# Altium schematic sheet power-sheet.SchDoc: Power Regulator
size 420 x 297 mm; CheckedBy: E.Orzes F.Martina S.Baron; CompanyName: CERN; DrawnBy: E.Orzes; Organization: CERN; Address1: European Organization for Nuclear Research; Address2: CH-1211 Genève 23 - Switzerland; SheetNumber: 7; SheetTotal: 7; Projet: Phase Stable Link; DivGrp: EP-ESE; Designer: E.Orzes; ModifiedDate: -
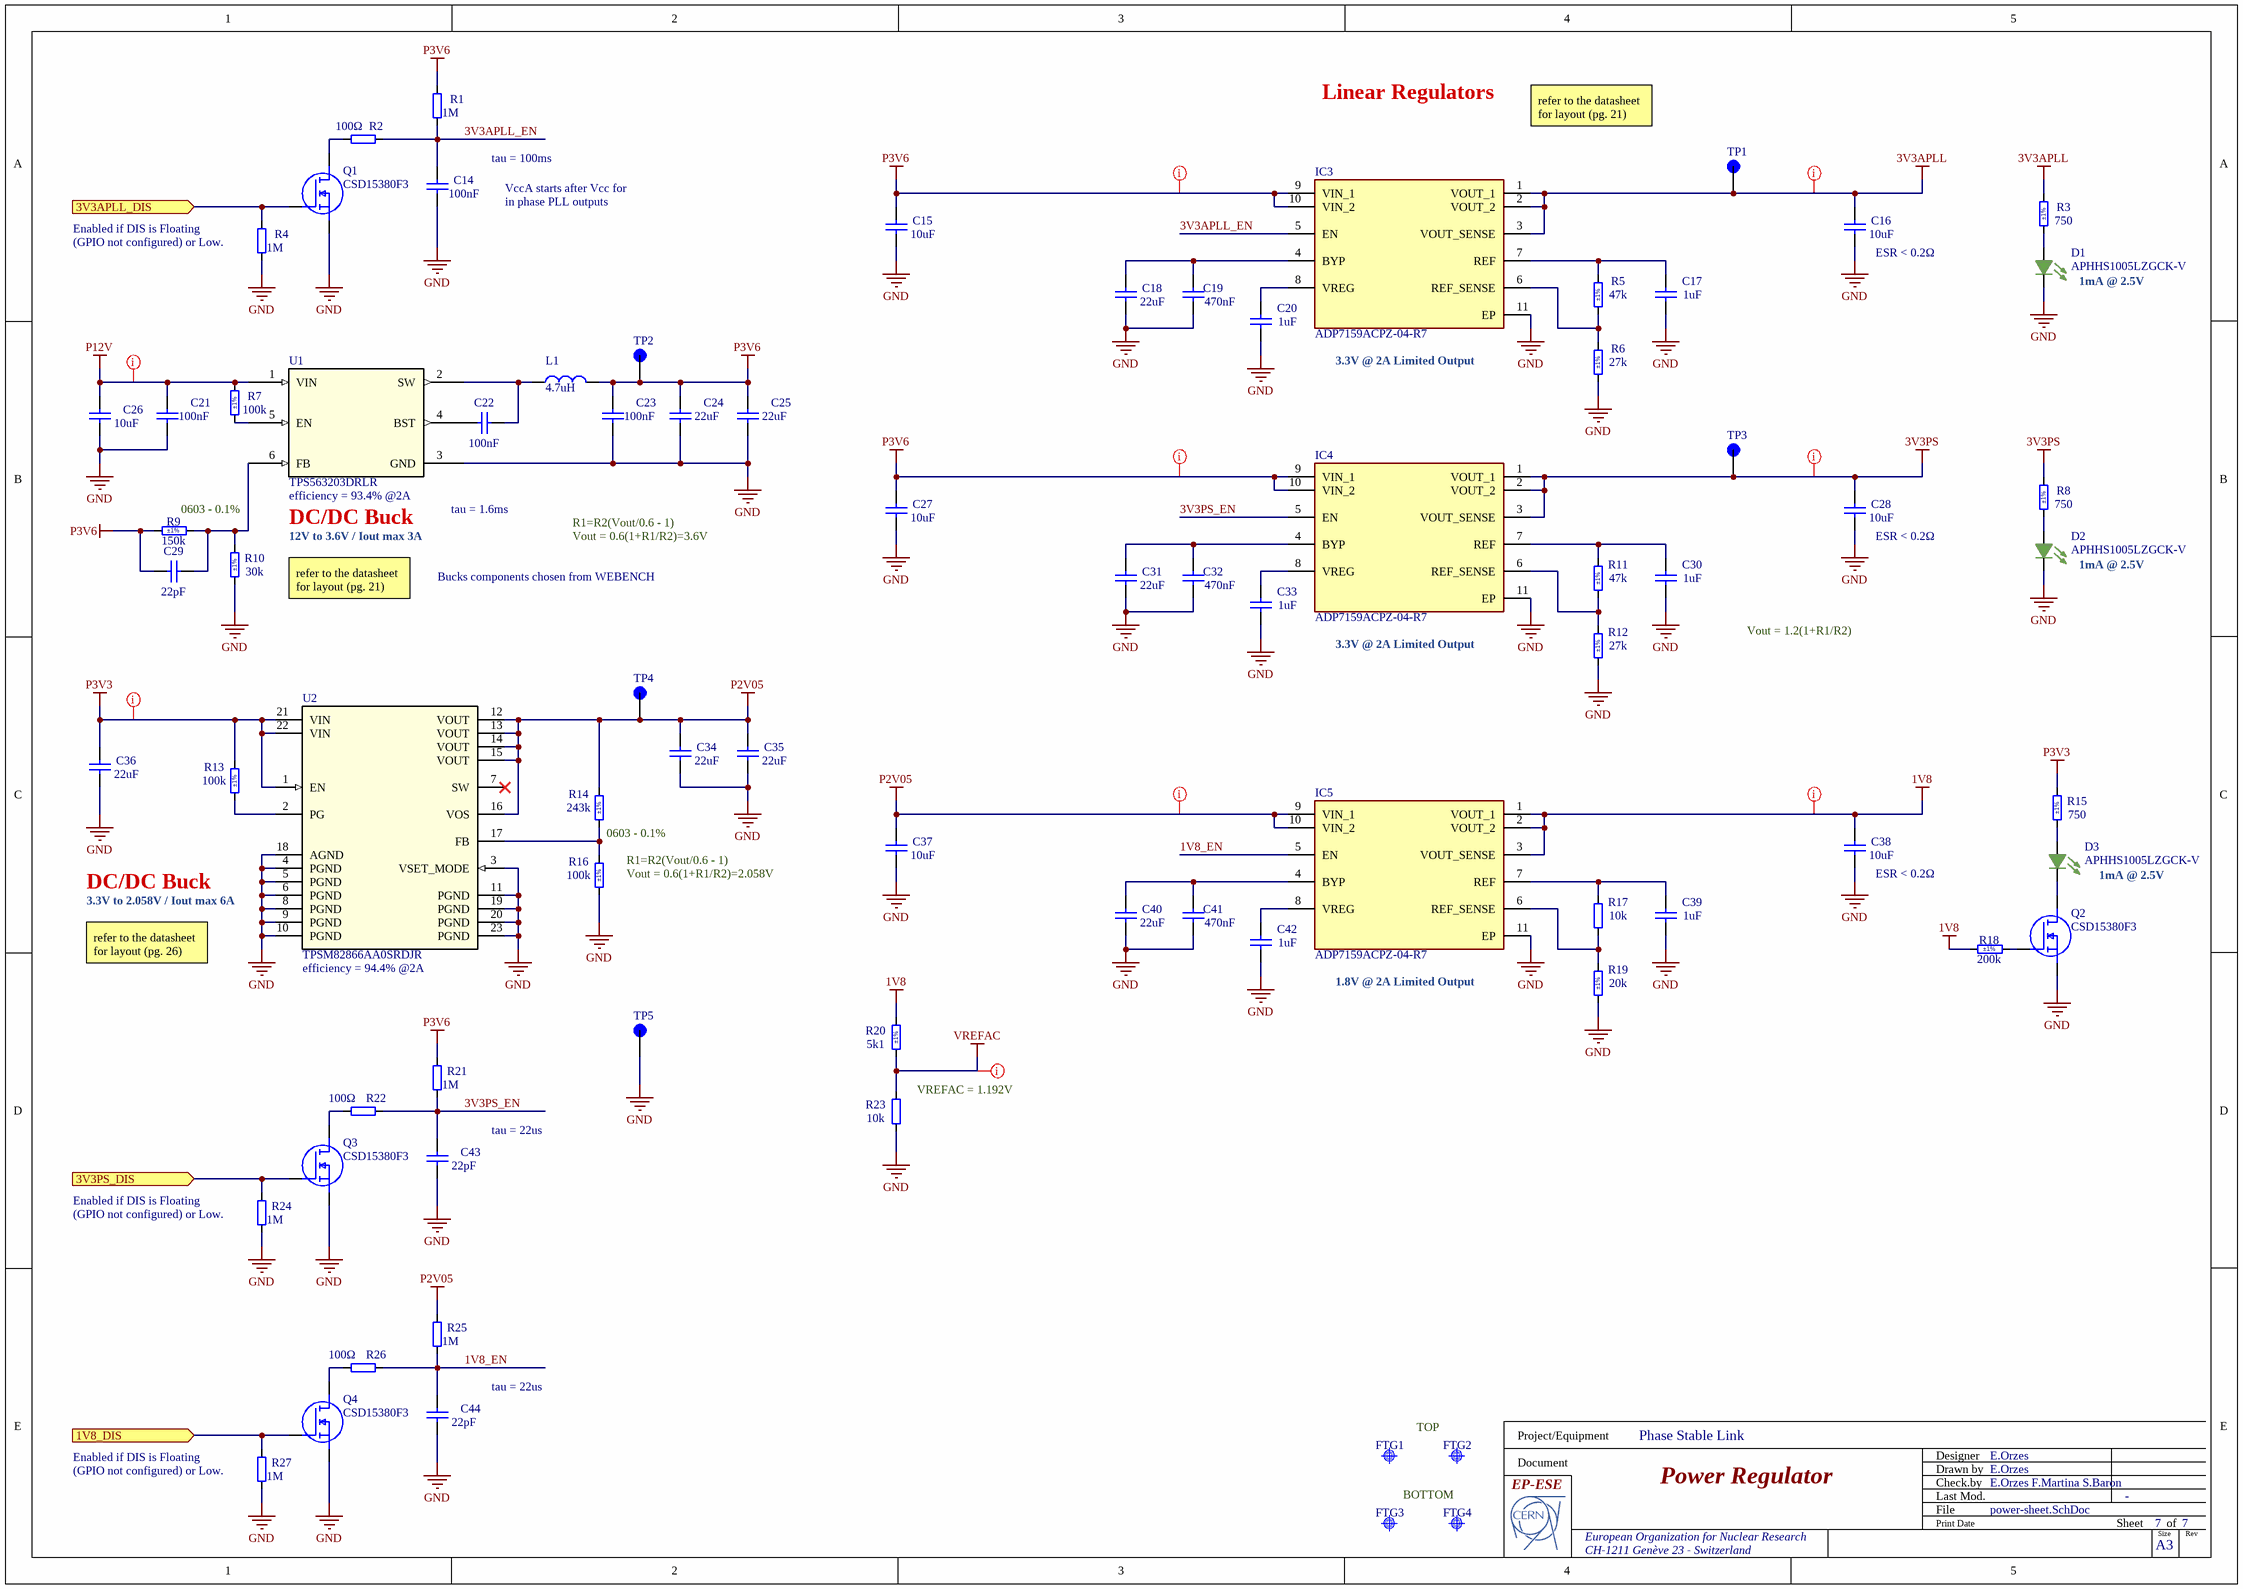
[diagram p0: power-sheet.SchDoc]

## Parts
C14  100nF  [MURATA_HI_DENSITY_0201]
C15  10uF  [CAPC1608X87N]
C16  10uF  [CAPC1608X87N]
C17  1uF  [CAPC1005X55N]
C18  22uF  [MURATA_HI_DENSITY_0402_CAP]
C19  470nF  [CAPC0510X04N]
C20  1uF  [CAPC1005X55N]
C21  100nF  [MURATA_HI_DENSITY_0402_CAP]
C22  100nF  [MURATA_HI_DENSITY_0402_CAP]
C23  100nF  [MURATA_HI_DENSITY_0402_CAP]
C24  22uF  [MURATA_HI_DENSITY_0402_CAP]
C25  22uF  [MURATA_HI_DENSITY_0402_CAP]
C26  10uF  [CAPC1608X87N]
C27  10uF  [CAPC1608X87N]
C28  10uF  [CAPC1608X87N]
C29  22pF  [MURATA_HI_DENSITY_0402_CAP]
C30  1uF  [CAPC1005X55N]
C31  22uF  [MURATA_HI_DENSITY_0402_CAP]
C32  470nF  [CAPC0510X04N]
C33  1uF  [CAPC1005X55N]
C34  22uF  [MURATA_HI_DENSITY_0402_CAP]
C35  22uF  [MURATA_HI_DENSITY_0402_CAP]
C36  22uF  [MURATA_HI_DENSITY_0402_CAP]
C37  10uF  [CAPC1608X87N]
C38  10uF  [CAPC1608X87N]
C39  1uF  [CAPC1005X55N]
C40  22uF  [MURATA_HI_DENSITY_0402_CAP]
C41  470nF  [CAPC0510X04N]
C42  1uF  [CAPC1005X55N]
C43  22pF  [MURATA_HI_DENSITY_0402_CAP]
C44  22pF  [MURATA_HI_DENSITY_0402_CAP]
D1  APHHS1005LZGCK-V  [LED_APHHS1005LZGCK-V]
D2  APHHS1005LZGCK-V  [LED_APHHS1005LZGCK-V]
D3  APHHS1005LZGCK-V  [LED_APHHS1005LZGCK-V]
FTG1  Use only in PCB  [FIDUCIAL_TOP_C100-200]  (value not drawn)
FTG2  Use only in PCB  [FIDUCIAL_TOP_C100-200]  (value not drawn)
FTG3  Use only in PCB  [FIDUCIAL_TOP_C100-200]  (value not drawn)
FTG4  Use only in PCB  [FIDUCIAL_TOP_C100-200]  (value not drawn)
IC3  ADP7159ACPZ-04-R7  [SON50P300X300X85-11N-D]
IC4  ADP7159ACPZ-04-R7  [SON50P300X300X85-11N-D]
IC5  ADP7159ACPZ-04-R7  [SON50P300X300X85-11N-D]
L1  4.7uH  [DFE322520FD1R0MP2]
Q1  CSD15380F3  [CSD15380F3]
Q2  CSD15380F3  [CSD15380F3]
Q3  CSD15380F3  [CSD15380F3]
Q4  CSD15380F3  [CSD15380F3]
R1  1M  [MURATA_HI_DENSITY_0201]
R2  100Ω  [MURATA_HI_DENSITY_0201]
R3  750  Tolerance: ±1%  [RESC1005X40N]
R4  1M  [MURATA_HI_DENSITY_0201]
R5  47k  Tolerance: ±1%  [RESC1005X40N]
R6  27k  Tolerance: ±1%  [RESC1005X40N]
R7  100k  Tolerance: ±1%  [RESC1608X55N]
R8  750  Tolerance: ±1%  [RESC1005X40N]
R9  150k  Tolerance: ±1%  [RESC1608X55N]
R10  30k  Tolerance: ±1%  [RESC1608X55N]
R11  47k  Tolerance: ±1%  [RESC1005X40N]
R12  27k  Tolerance: ±1%  [RESC1005X40N]
R13  100k  Tolerance: ±1%  [RESC1608X55N]
R14  243k  Tolerance: ±1%  [RESC1608X55N]
R15  750  Tolerance: ±1%  [RESC1005X40N]
R16  100k  Tolerance: ±1%  [RESC1608X55N]
R17  10k  [MURATA_HI_DENSITY_0201]
R18  200k  Tolerance: ±1%  [RESC1005X40N]
R19  20k  Tolerance: ±1%  [RESC1005X40N]
R20  5k1  Tolerance: ±1%  [RESC1005X40N]
R21  1M  [MURATA_HI_DENSITY_0201]
R22  100Ω  [MURATA_HI_DENSITY_0201]
R23  10k  [MURATA_HI_DENSITY_0201]
R24  1M  [MURATA_HI_DENSITY_0201]
R25  1M  [MURATA_HI_DENSITY_0201]
R26  100Ω  [MURATA_HI_DENSITY_0201]
R27  1M  [MURATA_HI_DENSITY_0201]
TP1  RCU-0C  [TP+195X110]  (value not drawn)
TP2  RCU-0C  [TP+195X110]  (value not drawn)
TP3  RCU-0C  [TP+195X110]  (value not drawn)
TP4  RCU-0C  [TP+195X110]  (value not drawn)
TP5  RCU-0C  [TP+195X110]  (value not drawn)
U1  TPS563203DRLR  [SOT_07SDRLR_TEX]
U2  TPSM82866AA0SRDJR  [RDJ0023A-MFG]

## Ports
1V8_DIS (in), 3V3APLL_DIS (in), 3V3PS_DIS (in)

## Nets
1V8: C38.2 IC5.1(VOUT_1) IC5.2(VOUT_2) IC5.3(VOUT_SENSE) R18.1 R20.2
3V3APLL: C16.2 IC3.1(VOUT_1) IC3.2(VOUT_2) IC3.3(VOUT_SENSE) R3.2 TP1.1(TP)
3V3PS: C28.2 IC4.1(VOUT_1) IC4.2(VOUT_2) IC4.3(VOUT_SENSE) R8.2 TP3.1(TP)
GND: C14.1 C15.1 C16.1 C17.1 C18.1 C19.1 C20.1 C21.2 C23.2 C24.1 C25.1 C26.1 C27.1 C28.1 C30.1 C31.1 C32.1 C33.1 C34.1 C35.1 C36.1 C37.1 C38.1 C39.1 C40.1 C41.1 C42.1 C43.2 C44.2 D1.1(C) D2.1(C) IC3.11(EP) IC4.11(EP) IC5.11(EP) Q1.2(S) Q2.2(S) Q3.2(S) Q4.2(S) R4.2 R6.1 R10.1 R12.1 R16.1 R19.1 R23.1 R24.2 R27.2 TP5.1(TP) U1.3(GND) U2.3(VSET_MODE) U2.4(PGND) U2.5(PGND) U2.6(PGND) U2.8(PGND) U2.9(PGND) U2.10(PGND) U2.11(PGND) U2.18(AGND) U2.19(PGND) U2.20(PGND) U2.23(PGND)
P2V05: C34.2 C35.2 C37.2 IC5.9(VIN_1) IC5.10(VIN_2) R14.2 R25.1 TP4.1(TP) U2.12(VOUT) U2.13(VOUT) U2.14(VOUT) U2.15(VOUT) U2.16(VOS)
P3V3: C36.2 R13.2 R15.2 U2.1(EN) U2.21(VIN) U2.22(VIN)
P3V6: C15.2 C23.1 C24.2 C25.2 C27.2 C29.2 IC3.9(VIN_1) IC3.10(VIN_2) IC4.9(VIN_1) IC4.10(VIN_2) L1.2 R1.1 R9.1 R21.1 TP2.1(TP)
P12V: C21.1 C26.2 R7.2 U1.1(VIN)
VREFAC: R20.1 R23.2
1V8_DIS: Q4.1(G) R27.1 ; port 1V8_DIS
1V8_EN: C44.1 IC5.5(EN) R25.2 R26.2
3V3APLL_DIS: Q1.1(G) R4.1 ; port 3V3APLL_DIS
3V3APLL_EN: C14.2 IC3.5(EN) R1.2 R2.2
3V3PS_DIS: Q3.1(G) R24.1 ; port 3V3PS_DIS
3V3PS_EN: C43.1 IC4.5(EN) R21.2 R22.2
NetC17_2: C17.2 IC3.7(REF) R5.2
NetC18_2: C18.2 C19.2 IC3.4(BYP)
NetC20_2: C20.2 IC3.8(VREG)
NetC22_1: C22.1 L1.1 U1.2(SW)
NetC22_2: C22.2 U1.4(BST)
NetC29_1: C29.1 R9.2 R10.2 U1.6(FB)
NetC30_2: C30.2 IC4.7(REF) R11.2
NetC31_2: C31.2 C32.2 IC4.4(BYP)
NetC33_2: C33.2 IC4.8(VREG)
NetC39_2: C39.2 IC5.7(REF) R17.2
NetC40_2: C40.2 C41.2 IC5.4(BYP)
NetC42_2: C42.2 IC5.8(VREG)
NetD1_2: D1.2(A) R3.1
NetD2_2: D2.2(A) R8.1
NetD3_1: D3.1(C) Q2.3(D)
NetD3_2: D3.2(A) R15.1
NetIC3_6: IC3.6(REF_SENSE) R5.1 R6.2
NetIC4_6: IC4.6(REF_SENSE) R11.1 R12.2
NetIC5_6: IC5.6(REF_SENSE) R17.1 R19.2
NetQ1_3: Q1.3(D) R2.1
NetQ2_1: Q2.1(G) R18.2
NetQ3_3: Q3.3(D) R22.1
NetQ4_3: Q4.3(D) R26.1
NetR7_1: R7.1 U1.5(EN)
NetR13_1: R13.1 U2.2(PG)
NetR14_1: R14.1 R16.2 U2.17(FB)

Not connected (* = marked no-connect by the designer): U2 7(SW)*

## Layout directives
net class Power: 1V8, 3V3APLL, 3V3PS, P2V05, P3V3, P3V6, P12V, VREFAC

## Notes on the sheet
- Linear Regulators
- refer to the datasheet for layout (pg. 21)
- tau = 100ms
- (near R4) Enabled if DIS is Floating (GPIO not configured) or Low.
- VccA starts after Vcc for in phase PLL outputs
- (near C16) ESR < 0.2Ω
- 1mA @ 2.5V
- (near IC3) 3.3V @ 2A Limited Output
- (near R9) 0603 - 0.1%
- DC/DC Buck
- (near U1) efficiency = 93.4% @2A
- (near U1) tau = 1.6ms
- R1=R2(Vout/0.6 - 1)
- 12V to 3.6V / Iout max 3A
- Bucks components chosen from WEBENCH
- Vout = 0.6(1+R1/R2)=3.6V
- (near C28) ESR < 0.2Ω
- (near IC4) 3.3V @ 2A Limited Output
- Vout = 1.2(1+R1/R2)
- (near R14) 0603 - 0.1%
- (near U2) 3.3V to 2.058V / Iout max 6A
- (near R16) Vout = 0.6(1+R1/R2)=2.058V
- (near C38) ESR < 0.2Ω
- refer to the datasheet for layout (pg. 26)
- (near U2) efficiency = 94.4% @2A
- (near IC5) 1.8V @ 2A Limited Output
- tau = 22us
- (near R23) VREFAC = 1.192V
- (near R24) Enabled if DIS is Floating (GPIO not configured) or Low.
- TOP
- (near R27) Enabled if DIS is Floating (GPIO not configured) or Low.
- BOTTOM
- Project/Equipment
- Document
- Designer
- Drawn by
- Check.by
- File
- Last Mod.
- Print Date
- Sheet
- Size
- A3
- of
- Rev

## Library data of the parts
C14 = C0201-100nF-high-density: GRM033R61C104KE14; Vmax: 16V; Value: 100nF
C15 C16 C26-C28 C37 C38 = CC0603_10UF_6.3V_20%_X5R: C1608X5R1E106M080AC; Part Description: SMD Multilayer Chip Ceramic Capacitor; Manufacturer: GENERIC; Manufacturer1 Part Number: C0603C106M9PAC; Voltage: 6.3V; TC: X5R; Tolerance: ±20%; Part Number: CC0603_10UF_6.3V_20%_X5R; Component Kind: Standard; Component Type: Standard; Pin Count: 2; Value: 10uF; Status: Preferred; Manufacturer Part Number: CC0603_10uF_6.3V_20%_X5R; Case: 0603; Mounted: Yes; Socket: No; SMD: Yes; Sense: No; Manufacturer1 Example: KEMET; Manufacturer1 ComponentHeight: 0.95mm; HelpURL: \\cern.ch\dfs\Applications\Altium\Datasheets\CC0603_X5R_KEMET.pdf; Author: CERN DEM JLC; CreateDate: 03/12/2007; LatestRevisionDate: 03/12/2007
C17 C20 C30 C33 C39 C42 = CC0402_1UF_16V_10%_X5R: GRM153B30J105ME15; Part Description: SMD Multilayer Chip Ceramic Capacitor; Manufacturer: GENERIC; Manufacturer1 Part Number: C1005X5R1C105KT; Voltage: 16V; TC: X5R; Tolerance: ±10%; Part Number: CC0402_1UF_16V_10%_X5R; Component Kind: Standard; Component Type: Standard; Pin Count: 2; Value: 1uF; Status: Preferred; Manufacturer Part Number: CC0402_1UF_16V_10%_X5R; Case: 0402; Mounted: Yes; Socket: No; SMD: Yes; Sense: No; Manufacturer1 Example: TDK; Manufacturer1 ComponentHeight: 0.55mm; HelpURL: \\cern.ch\dfs\Applications\Altium\Datasheets\CC0402_X5R_TDK_C.pdf; Author: CERN DEM JLC; CreateDate: 10/25/2012; LatestRevisionDate: 10/25/2012
C18 C24 C25 C31 C34-C36 C40 = C0402-22uF-high-density: GRM155R60J226ME11; Vmax: 6.3V; Value: 22uF
C19 C32 C41 = Capacitor - non polarized: LLL153C70G474ME17; Value: 470nF
C21-C23 = C0402-22uF-high-density: GRM155R71E104KE14; Value: 22uF; Vmax: 6.3V
C29 C43 C44 = C0402-22uF-high-density: C0402C220J4GACTU; Value: 22uF; Vmax: 6.3V
D1-D3 = APHHS1005LZGCK-V: Led Green 0402 2mA 2.65V 40mcd 102mW; MF: Kingbright Corporation; SnapEDA_Link: https://www.snapeda.com/parts/APHHS1005LZGCK-V/Kingbright/view-part/?ref=snap; Package: 0402 Kingbright Corporation; Value: *; MP: APHHS1005LZGCK-V; Check_prices: https://www.snapeda.com/parts/APHHS1005LZGCK-V/Kingbright/view-part/?ref=eda
FTG1-FTG4 = FIDUCIAL_TARGET_C100-200: Fiducial Target; Part Description: Round Fiducial Target, Top Layer, 1.0mm, Top Solder 2.0mm, Keepout =2.0mm; Mounted: No; Part Number: FIDUCIAL_TARGET_C100-200; Component Kind: Standard (No BOM); Component Type: Standard (No BOM); Pin Count: 1; Family: Fiducial; Socket: No; SMD: Yes; Sense: No; Status: None; ComponentHeight: 0mm; HelpURL: Undefined; Author: CERN DEM JLC; CreateDate: 09/02/2010; LatestRevisionDate: 04/04/2012; PackageDescription: Round Fiducial Target, Top Layer, 1.0mm, Top Solder 2.0mm, Keepout =2.0mm
IC3-IC5 = ADP7159ACPZ-04-R7: Integrated Circuit; Manufacturer_Name: Analog Devices; Datasheet Link: https://www.analog.com/media/en/technical-documentation/data-sheets/ADP7159.pdf; Height: 0.85mm; Manufacturer_Part_Number: ADP7159ACPZ-04-R7; Mouser Part Number: 584-ADP7159ACPZ04R7; Mouser Price/Stock: https://www.mouser.co.uk/ProductDetail/Analog-Devices/ADP7159ACPZ-04-R7?qs=JeIcUl65ClBXEAZRPtHUVQ%3D%3D; Arrow Part Number: ADP7159ACPZ-04-R7; Arrow Price/Stock: https://www.arrow.com/en/products/adp7159acpz-04-r7/analog-devices
L1 = DFE322520FD-4R7M=P2: Inductor; Manufacturer_Name: Murata Electronics; Datasheet Link: https://search.murata.co.jp/Ceramy/image/img/P02/J(E)TE243A-9104.pdf; Height: 2mm; Manufacturer_Part_Number: DFE322520FD-4R7M=P2; Mouser Part Number: 81-DFE322520FD4R7MP2; Mouser Price/Stock: https://www.mouser.co.uk/ProductDetail/Murata-Electronics/DFE322520FD-4R7M%3dP2?qs=17u8i%2FzlE8%252BgAY54mivQ1g%3D%3D; Arrow Part Number: DFE322520FD-4R7M=P2; Arrow Price/Stock: https://www.arrow.com/en/products/dfe322520fd-4r7mp2/murata-manufacturing?region=nac
Q1-Q4 = CSD15380F3: MOSFET (N-Channel); Manufacturer_Name: Texas Instruments; Datasheet Link: https://www.ti.com/lit/ds/symlink/csd15380f3.pdf?ts=1641221366106&ref_url=https%253A%252F%252Fwww.google.com%252F; Height: 0.35mm; Manufacturer_Part_Number: CSD15380F3; Mouser Part Number: 595-CSD15380F3; Mouser Price/Stock: https://www.mouser.co.uk/ProductDetail/Texas-Instruments/CSD15380F3?qs=zEmsApcVOkXP46xhm0edmA%3D%3D; Arrow Part Number: CSD15380F3; Arrow Price/Stock: https://www.arrow.com/en/products/csd15380f3/texas-instruments?region=nac
R1 R4 R17 R21 R23-R25 R27 = R0201-100ohm-high-density: Resistor 10k; Value: 100Ω
R2 R22 R26 = R0201-100ohm-high-density: Resistor; Value: 100Ω
R3 R8 R15 = R0402_750R_1%_0.0625W_100PPM: Resistor - 1%; Part Description: General Purpose Thick Film Chip Resistor; Manufacturer: GENERIC; Manufacturer1 Part Number: 232270677501L; TC: ±100ppm/°C; PressFit: No; Part Number: R0402_750R_1%_0.0625W_100PPM; Component Kind: Standard; Component Type: Standard; Pin Count: 2; Value: 750; Status: Not Recommended; Power: 0.0625W; Manufacturer Part Number: R0402_750R_1%_0.0625W_100PPM; Case: 0402; Mounted: Yes; Sense: No; Socket: No; SMD: Yes; Manufacturer1 Example: YAGEO PHYCOMP; Manufacturer1 ComponentHeight: 0.4mm; HelpURL: \\cern.ch\dfs\Applications\Altium\Datasheets\R0402_Phycomp_RC0402.pdf; Author: CERN DEM JLC; CreateDate: 12/3/2007; LatestRevisionDate: 10/17/2012
R5 R11 = R0402_47K_1%_0.0625W_100PPM: Resistor - 1%; Part Description: General Purpose Thick Film Chip Resistor; Manufacturer: GENERIC; Manufacturer1 Part Number: 232270674703L; TC: ±100ppm/°C; PressFit: No; Part Number: R0402_47K_1%_0.0625W_100PPM; Component Kind: Standard; Component Type: Standard; Pin Count: 2; Value: 47k; Status: Not Recommended; Power: 0.0625W; Manufacturer Part Number: R0402_47K_1%_0.0625W_100PPM; Case: 0402; Mounted: Yes; Sense: No; Socket: No; SMD: Yes; Manufacturer1 Example: YAGEO PHYCOMP; Manufacturer1 ComponentHeight: 0.4mm; HelpURL: \\cern.ch\dfs\Applications\Altium\Datasheets\R0402_Phycomp_RC0402.pdf; Author: CERN DEM JLC; CreateDate: 12/3/2007; LatestRevisionDate: 10/17/2012
R6 R12 = R0402_27K_1%_0.0625W_100PPM: Resistor - 1%; Part Description: General Purpose Thick Film Chip Resistor; Manufacturer: GENERIC; Manufacturer1 Part Number: 232270672703L; TC: ±100ppm/°C; PressFit: No; Part Number: R0402_27K_1%_0.0625W_100PPM; Component Kind: Standard; Component Type: Standard; Pin Count: 2; Value: 27k; Status: Not Recommended; Power: 0.0625W; Manufacturer Part Number: R0402_27K_1%_0.0625W_100PPM; Case: 0402; Mounted: Yes; Sense: No; Socket: No; SMD: Yes; Manufacturer1 Example: YAGEO PHYCOMP; Manufacturer1 ComponentHeight: 0.4mm; HelpURL: \\cern.ch\dfs\Applications\Altium\Datasheets\R0402_Phycomp_RC0402.pdf; Author: CERN DEM JLC; CreateDate: 12/3/2007; LatestRevisionDate: 10/17/2012
R7 R13 R14 R16 = R0603_30K_1%_0.1W_100PPM: Resistor - 1%; Part Description: General Purpose Thick Film Chip Resistor; Manufacturer: GENERIC; Manufacturer1 Part Number: NRC06F3002TRF; Value: 30k; Power: 0.1W; TC: ±100ppm/°C; PressFit: No; Part Number: R0603_30K_1%_0.1W_100PPM; Component Kind: Standard; Component Type: Standard; Pin Count: 2; Status: Preferred; Manufacturer Part Number: R0603_30K_1%_0.1W_100PPM; Case: 0603; Mounted: Yes; Sense: No; Socket: No; SMD: Yes; Manufacturer1 Example: NIC COMPONENT; Manufacturer1 ComponentHeight: 0.55mm; HelpURL: \\cern.ch\dfs\Applications\Altium\Datasheets\R0603_NIC_NRC.pdf; Author: CERN DEM JLC; CreateDate: 12/3/2007; LatestRevisionDate: 3/13/2008
R9 = R0603_150K_1%_0.1W_100PPM: Resistor - 1%; Part Description: General Purpose Thick Film Chip Resistor; Manufacturer: GENERIC; Manufacturer1 Part Number: NRC06F1503TRF; Power: 0.1W; TC: ±100ppm/°C; PressFit: No; Part Number: R0603_150K_1%_0.1W_100PPM; Component Kind: Standard; Component Type: Standard; Pin Count: 2; Value: 150k; Status: Preferred; Manufacturer Part Number: R0603_150K_1%_0.1W_100PPM; Case: 0603; Mounted: Yes; Sense: No; Socket: No; SMD: Yes; Manufacturer1 Example: NIC COMPONENT; Manufacturer1 ComponentHeight: 0.55mm; HelpURL: \\cern.ch\dfs\Applications\Altium\Datasheets\R0603_NIC_NRC.pdf; Author: CERN DEM JLC; CreateDate: 12/3/2007; LatestRevisionDate: 3/13/2008
R10 = R0603_30K_1%_0.1W_100PPM: Resistor - 1%; Part Description: General Purpose Thick Film Chip Resistor; Manufacturer: GENERIC; Manufacturer1 Part Number: NRC06F3002TRF; Power: 0.1W; TC: ±100ppm/°C; PressFit: No; Part Number: R0603_30K_1%_0.1W_100PPM; Component Kind: Standard; Component Type: Standard; Pin Count: 2; Value: 30k; Status: Preferred; Manufacturer Part Number: R0603_30K_1%_0.1W_100PPM; Case: 0603; Mounted: Yes; Sense: No; Socket: No; SMD: Yes; Manufacturer1 Example: NIC COMPONENT; Manufacturer1 ComponentHeight: 0.55mm; HelpURL: \\cern.ch\dfs\Applications\Altium\Datasheets\R0603_NIC_NRC.pdf; Author: CERN DEM JLC; CreateDate: 12/3/2007; LatestRevisionDate: 3/13/2008
R18 = R0402_200K_1%_0.0625W_100PPM: Resistor - 1%; Part Description: General Purpose Thick Film Chip Resistor; Manufacturer: GENERIC; Manufacturer1 Part Number: 232270672004L; TC: ±100ppm/°C; PressFit: No; Part Number: R0402_200K_1%_0.0625W_100PPM; Component Kind: Standard; Component Type: Standard; Pin Count: 2; Value: 200k; Status: Not Recommended; Power: 0.0625W; Manufacturer Part Number: R0402_200K_1%_0.0625W_100PPM; Case: 0402; Mounted: Yes; Sense: No; Socket: No; SMD: Yes; Manufacturer1 Example: YAGEO PHYCOMP; Manufacturer1 ComponentHeight: 0.4mm; HelpURL: \\cern.ch\dfs\Applications\Altium\Datasheets\R0402_Phycomp_RC0402.pdf; Author: CERN DEM JLC; CreateDate: 12/3/2007; LatestRevisionDate: 10/17/2012
R19 = R0402_20K_1%_0.0625W_100PPM: Resistor - 1%; Part Description: General Purpose Thick Film Chip Resistor; Manufacturer: GENERIC; Manufacturer1 Part Number: 232270672003L; TC: ±100ppm/°C; PressFit: No; Part Number: R0402_20K_1%_0.0625W_100PPM; Component Kind: Standard; Component Type: Standard; Pin Count: 2; Value: 20k; Status: Not Recommended; Power: 0.0625W; Manufacturer Part Number: R0402_20K_1%_0.0625W_100PPM; Case: 0402; Mounted: Yes; Sense: No; Socket: No; SMD: Yes; Manufacturer1 Example: YAGEO PHYCOMP; Manufacturer1 ComponentHeight: 0.4mm; HelpURL: \\cern.ch\dfs\Applications\Altium\Datasheets\R0402_Phycomp_RC0402.pdf; Author: CERN DEM JLC; CreateDate: 12/3/2007; LatestRevisionDate: 10/17/2012
R20 = R0402_5K1_1%_0.0625W_100PPM: Resistor - 1%; Part Description: General Purpose Thick Film Chip Resistor; Manufacturer: GENERIC; Manufacturer1 Part Number: 232270675102L; TC: ±100ppm/°C; PressFit: No; Part Number: R0402_5K1_1%_0.0625W_100PPM; Component Kind: Standard; Component Type: Standard; Pin Count: 2; Value: 5k1; Status: Not Recommended; Power: 0.0625W; Manufacturer Part Number: R0402_5K1_1%_0.0625W_100PPM; Case: 0402; Mounted: Yes; Sense: No; Socket: No; SMD: Yes; Manufacturer1 Example: YAGEO PHYCOMP; Manufacturer1 ComponentHeight: 0.4mm; HelpURL: \\cern.ch\dfs\Applications\Altium\Datasheets\R0402_Phycomp_RC0402.pdf; Author: CERN DEM JLC; CreateDate: 03/12/2007; LatestRevisionDate: 17/10/2012
TP1-TP5 = RCU-0C: MF: {'manufacturer': u'TE Connectivity AMP Connectors'}; Package: None; Price: None; Value: *; MP: RCU-0C; Availability: Unavailable
U1 = TPS563203DRLR: No Description Available; Mfr_Name: Texas Instruments; Type: Power Management; RefDes: RefDes
U2 = XPSM82866AA0SRDJR: No Description Available; Mfr_Name: Texas Instruments; TYPE: TYPE; RefDes: RefDes